# Altium schematic sheet main_board.SchDoc
size A3
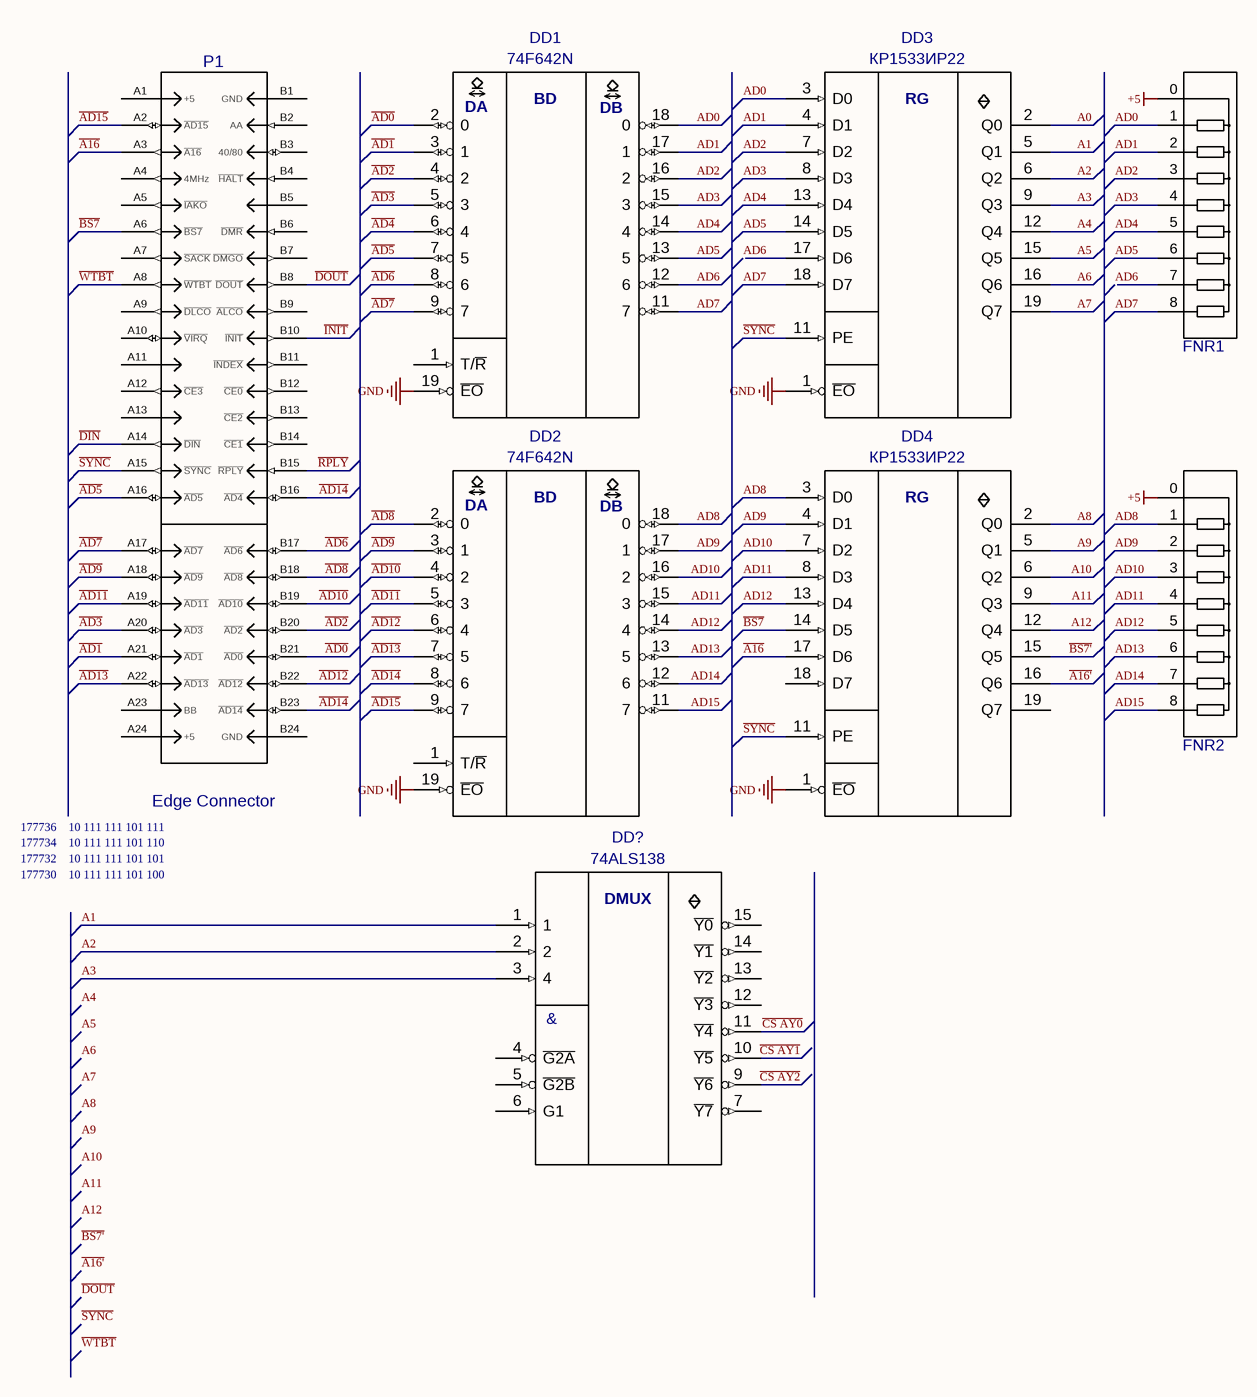
[diagram p0: main_board.SchDoc]

## Parts
DD1  74F642N  [2140.20-4]
DD2  74F642N  [2140.20-4]
DD3  КР1533ИР22  [2140.20-4]
DD4  КР1533ИР22  [2140.20-4]
DD?  74ALS138
FNR1  FNR8  (value not drawn)
FNR2  FNR8  (value not drawn)
P1  Edge Connector

## Nets
GND: DD1.19(~{EO}) DD2.19(~{EO}) DD3.1(~{EO}) DD4.1(~{EO})
A0: DD3.2(Q0)
A1: DD3.5(Q1) DD?.1
A2: DD3.6(Q2) DD?.2
A3: DD3.9(Q3) DD?.3(4)
A4: DD3.12(Q4)
A5: DD3.15(Q5)
A6: DD3.16(Q6)
A7: DD3.19(Q7)
A8: DD4.2(Q0)
A9: DD4.5(Q1)
A10: DD4.6(Q2)
A11: DD4.9(Q3)
A12: DD4.12(Q4)
~{A16}: DD4.17(D6) P1.A3(~{A16})
~{A16'}: DD4.16(Q6)
~{AD0}: DD1.2(0) P1.B21(~{AD0})
~{AD1}: DD1.3(1) P1.A21(~{AD1})
~{AD10}: DD2.4(2) P1.B19(~{AD10})
~{AD11}: DD2.5(3) P1.A19(~{AD11})
~{AD12}: DD2.6(4) P1.B22(~{AD12})
~{AD13}: DD2.7(5) P1.A22(~{AD13})
~{AD14}: DD2.8(6) P1.B16(~{AD4}) P1.B23(~{AD14})
~{AD15}: DD2.9(7) P1.A2(~{AD15})
~{AD2}: DD1.4(2) P1.B20(~{AD2})
~{AD3}: DD1.5(3) P1.A20(~{AD3})
~{AD4}: DD1.6(4)
~{AD5}: DD1.7(5) P1.A16(~{AD5})
~{AD6}: DD1.8(6) P1.B17(~{AD6})
~{AD7}: DD1.9(7) P1.A17(~{AD7})
~{AD8}: DD2.2(0) P1.B18(~{AD8})
~{AD9}: DD2.3(1) P1.A18(~{AD9})
AD0: DD1.18(0) DD3.3(D0)
AD1: DD1.17(1) DD3.4(D1)
AD2: DD1.16(2) DD3.7(D2)
AD3: DD1.15(3) DD3.8(D3)
AD4: DD1.14(4) DD3.13(D4)
AD5: DD1.13(5) DD3.14(D5)
AD6: DD1.12(6)
AD7: DD1.11(7) DD3.18(D7)
AD8: DD2.18(0) DD4.3(D0)
AD9: DD2.17(1) DD4.4(D1)
AD10: DD2.16(2) DD4.7(D2)
AD11: DD2.15(3) DD4.8(D3)
AD12: DD2.14(4) DD4.13(D4)
AD13: DD2.13(5)
AD14: DD2.12(6)
AD15: DD2.11(7)
~{BS7}: DD4.14(D5) P1.A6(~{BS7})
~{BS7'}: DD4.15(Q5)
~{CS AY0}: DD?.11(~{Y4})
~{CS AY1}: DD?.10(~{Y5})
~{CS AY2}: DD?.9(~{Y6})
~{DIN}: P1.A14(~{DIN})
~{DOUT}: P1.B8(~{DOUT})
~{INIT}: P1.B10(~{INIT})
~{RPLY}: P1.B15(~{RPLY})
~{SYNC}: DD3.11(PE) DD4.11(PE) P1.A15(~{SYNC})
~{WTBT}: P1.A8(~{WTBT})

Not connected (* = marked no-connect by the designer): DD1 1(T/~{R}) 10(GND) 20(Vcc); DD2 1(T/~{R}) 10(GND) 20(Vcc); DD3 10(GND) 17(D6) 20(+5V); DD4 10(GND) 18(D7) 19(Q7) 20(+5V); DD? 4(~{G2A}) 5(~{G2B}) 6(G1) 7(~{Y7}) 8(GND) 12(~{Y3}) 13(~{Y2}) 14(~{Y1}) 15(~{Y0}) 16(+5); FNR1 0 1 2 3 4 5 6 7 8; FNR2 0 1 2 3 4 5 6 7 8; P1 A1(+5) A4(4MHz) A5(~{IAKO}) A7(~{SACK}) A9(~{DLCO}) A10(~{VIRQ}) A11 A12(~{CE3}) A13 A23(BB) A24(+5) B1(GND) B2(AA) B3(40/80) B4(~{HALT}) B5 B6(~{DMR}) B7(~{DMGO}) B9(~{ALCO}) B11(~{INDEX}) B12(~{CE0}) B13(~{CE2}) B14(~{CE1}) B24(GND)

## Notes on the sheet
- 177736
- 10 111 111 101 111
- 177734
- 177732
- 177730
- 10 111 111 101 110
- 10 111 111 101 101
- 10 111 111 101 100
- Labels drawn without touching a wire or pin: +5, A4, A5, A6, A7, A8, A9, A10, A11, A12, AD6, ~{A16'}, ~{BS7'}, ~{DOUT}, ~{SYNC}, ~{WTBT}
- (in symbol 74ALS138) DMUX; &
- (in symbol 74F642N) BD; DA; DB
- (in symbol КР1533ИР22(74ALS373)) RG

## Library data of the parts
DD3 DD4 = КР1533ИР22(74ALS373): Value: *
DD? = 74ALS138: КР1533ИД7; Value: *
P1 = SNP15-48 EDGE: Value: *
DD1 DD2 = 74F642N: Value: *